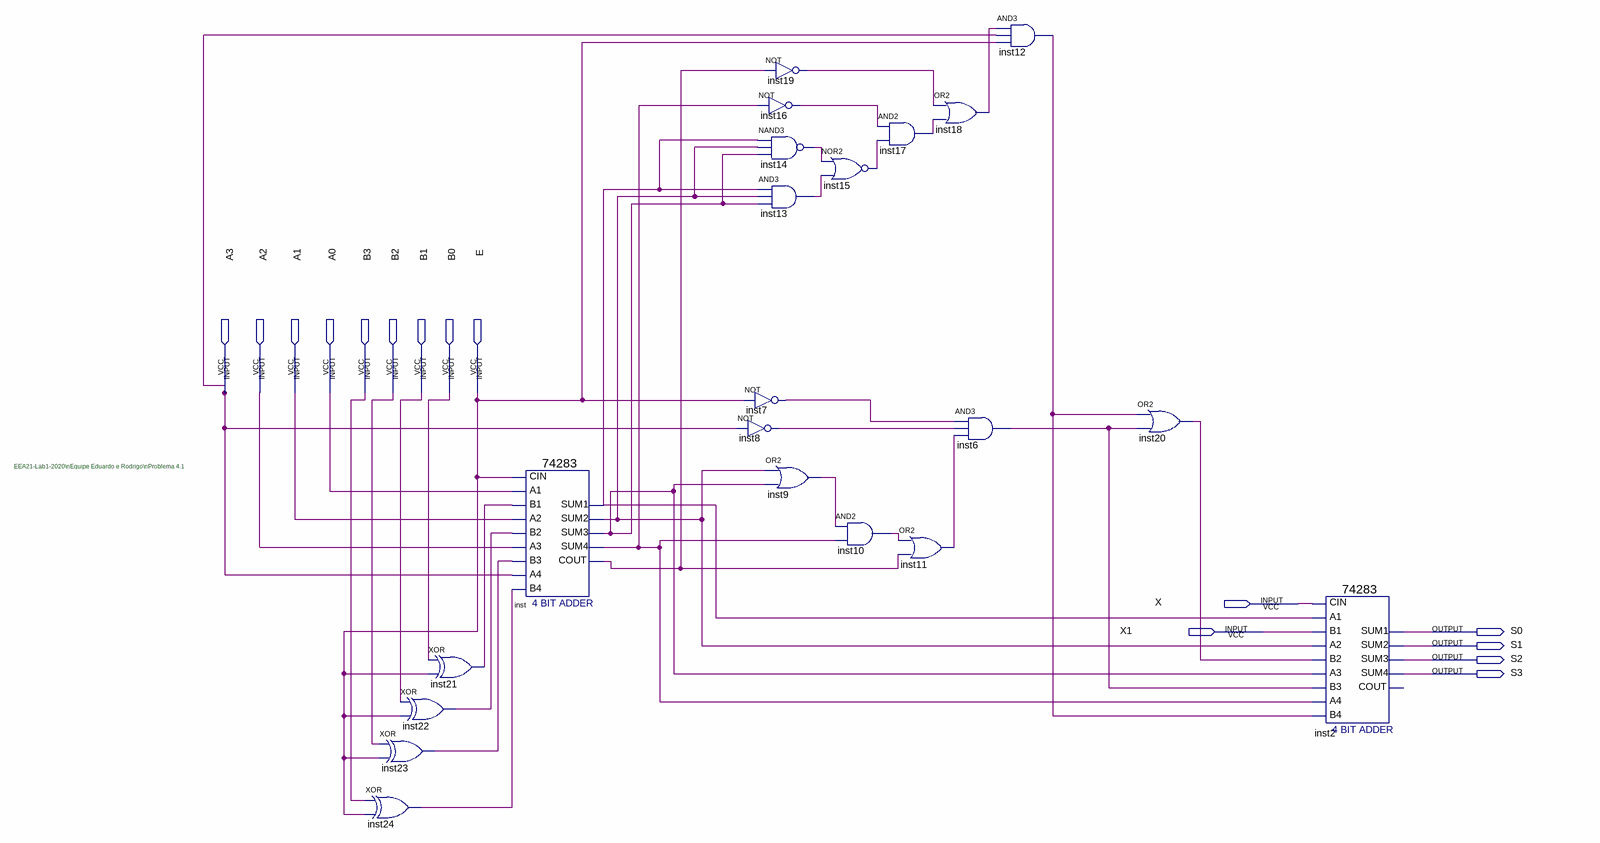
[diagram p0: schematic sheet]
// Quartus schematic questao611.bdf as structural Verilog: 21 symbols, 15 pins
module questao611 (
  input  A3,
  input  A2,
  input  A1,
  input  A0,
  input  B3,
  input  B2,
  input  B1,
  input  B0,
  input  E,
  input  X,
  input  X1,
  output S0,
  output S1,
  output S2,
  output S3
);

  wire inst6_out, inst7_out, inst8_out, inst9_out, inst10_out, inst11_out, inst12_out, inst13_out,
       inst14_out, inst15_out, inst16_out, inst17_out, inst18_out, inst19_out, inst20_out, inst21_out,
       inst22_out, inst23_out, inst24_out, inst_cout, inst_sum1, inst_sum2, inst_sum3, inst_sum4;

  xor inst24 (inst24_out, B3, E);
  xor inst21 (inst21_out, B0, E);
  xor inst22 (inst22_out, B1, E);
  xor inst23 (inst23_out, B2, E);
  \74283  inst (
    .CIN(E), .A1(A0), .A2(A1), .B2(inst22_out), .A3(A2), .A4(A3), .B4(inst24_out), .B1(inst21_out),
    .B3(inst23_out), .SUM4(inst_sum4), .COUT(inst_cout), .SUM1(inst_sum1), .SUM2(inst_sum2), .SUM3(inst_sum3));
  not inst19 (inst19_out, inst_cout);
  not inst16 (inst16_out, inst_sum4);
  nand inst14 (inst14_out, inst_sum1, inst_sum2, inst_sum3);
  and inst13 (inst13_out, inst_sum1, inst_sum2, inst_sum3);
  not inst7 (inst7_out, E);
  not inst8 (inst8_out, A3);
  or inst9 (inst9_out, inst_sum2, inst_sum3);
  nor inst15 (inst15_out, inst14_out, inst13_out);
  and inst17 (inst17_out, inst16_out, inst15_out);
  and inst10 (inst10_out, inst9_out, inst_sum4);
  or inst18 (inst18_out, inst19_out, inst17_out);
  or inst11 (inst11_out, inst10_out, inst_cout);
  and inst6 (inst6_out, inst7_out, inst8_out, inst11_out);
  and inst12 (inst12_out, inst18_out, A3, E);
  or inst20 (inst20_out, inst12_out, inst6_out);
  \74283  inst2 (
    .CIN(X), .A1(inst_sum1), .A2(inst_sum2), .B2(inst20_out), .A3(inst_sum3), .A4(inst_sum4),
    .B4(inst12_out), .B1(X1), .B3(inst6_out), .SUM4(S3), .SUM1(S0), .SUM2(S1), .SUM3(S2));  // open: COUT

  // Notes on the sheet:
  //   EEA21-Lab1-2020\nEquipe Eduardo e Rodrigo\nProblema 4.1
endmodule
